# EAGLE schematic untitled (EAGLE 6.6.0)
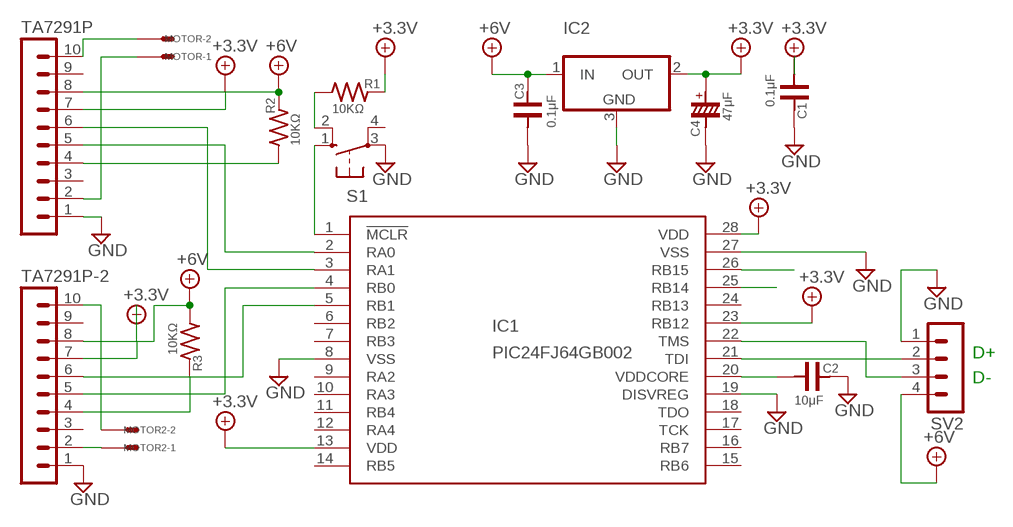
[diagram p0: schematic, sheet 1]

## Parts
C1  0.1μF  C25  [C25-25X44]
C2  10μF  C25  [C25-25X44]
C3  0.1μF  C25  [C25-25X44]
C4  47μF  POLCL  [TT2D5L]
IC1  PIC24FJ64GB002  [DIL28-3]
IC2  TA48MV  [HSIP3-P2.30B/V]
MOTOR  CON2S  [CON2]
MOTOR2  CON2S  [CON2]
R1  10KΩ  R  [0204/5]
R2  10KΩ  R  [0204/5]
R3  10KΩ  R  [0204/5]
S1  10-XX  [B3F-10XX]
SV2  MA04-1  [MA04-1]
TA7291P  MA10-1  [MA10-1]
TA7291P-2  MA10-1  [MA10-1]

## Nets
+4.1V: C1.P$1 C4.P$1 IC1.13(VDD) IC1.23(RB12) IC1.28(VDD) IC2.2(OUT) R1.2 TA7291P-2.7 TA7291P.7 ; supply symbol labelled +3.3V
+5V: C3.P$2 IC2.1(IN) R2.2 R3.1 SV2.4 TA7291P-2.8 TA7291P.8 ; supply symbol labelled +6V
GND: C1.P$2 C2.P$2 C3.P$1 C4.P$2 IC1.8(VSS) IC1.19(DISVREG) IC1.27(VSS) IC2.3(GND) S1.3(P) SV2.1 TA7291P-2.1 TA7291P.1
N$1: IC1.26(RB15)
N$2: R1.1 S1.2(S1)
N$3: IC1.1(!MCLR) S1.1(S)
N$4: C2.P$1 IC1.20(VDDCORE)
N$5: IC1.21(TDI) SV2.2
N$6: IC1.22(TMS) SV2.3
N$7: R2.1 TA7291P.4
N$8: IC1.2(RA0) TA7291P.5
N$9: IC1.3(RA1) TA7291P.6
N$10: MOTOR.P$1 TA7291P.2
N$11: MOTOR.P$2 TA7291P.10
N$12: R3.2 TA7291P-2.4
N$13: IC1.4(RB0) TA7291P-2.5
N$14: IC1.5(RB1) TA7291P-2.6
N$15: MOTOR2.P$1 TA7291P-2.2
N$16: MOTOR2.P$2 TA7291P-2.10
N$17: IC1.25(RB14)
Unconnected: IC1.6(RB2) IC1.7(RB3) IC1.9(RA2) IC1.10(RA3) IC1.11(RB4) IC1.12(RA4) IC1.14(RB5) IC1.15(RB6) IC1.16(RB7) IC1.17(TCK) IC1.18(TDO) IC1.24(RB13) S1.4(P1) TA7291P-2.3 TA7291P-2.9 TA7291P.3 TA7291P.9

## Notes on the sheet
- D+
- D-

## Library data of the parts
C1-C3 = 00_jikken:C
C4 = 00_jikken:POLC
IC1 = 00_microchip:PIC24FJ64GB002: PIC24FJ64GA002 edit this description Auto generated by make-symbol-device-package-bsdl.ulp Rev. 25 Source: PIC24FJ64GA002.bsd; MPN: PIC24FJ64GA002-I/SP; OC_FARNELL: 1332298; OC_NEWARK: 88K6132
IC2 = 00_kamiki:TA48M*: Three-Terminal Low Dropout Voltage Regulator
MOTOR MOTOR2 = 00_jikken:CON2S
R1-R3 = 00_jikken:R
S1 = switch-omron:10-XX: OMRON SWITCH; MPN: B3F-1000; OC_FARNELL: 176432; OC_NEWARK: 36M3542
SV2 = 00_con-lstb:MA04-1: PIN HEADER; OC_FARNELL: unknown; OC_NEWARK: unknown
TA7291P TA7291P-2 = 00_con-lstb:MA10-1: PIN HEADER; OC_FARNELL: unknown; OC_NEWARK: unknown